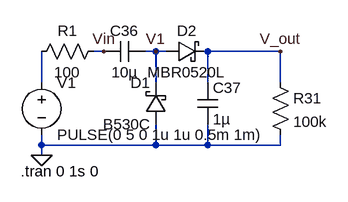
[diagram p0: schematic t_protection.asc]
t_protection.asc, the LTspice schematic file:
Version 4
SHEET 1 880 680
WIRE 112 80 96 80
WIRE 192 80 176 80
WIRE 208 80 192 80
WIRE 384 80 272 80
WIRE 16 128 16 80
WIRE 192 128 192 80
WIRE 272 128 272 80
WIRE 384 128 384 80
WIRE 16 224 16 208
WIRE 192 224 192 192
WIRE 192 224 16 224
WIRE 272 224 272 192
WIRE 272 224 192 224
WIRE 384 224 384 208
WIRE 384 224 272 224
WIRE 16 240 16 224
FLAG 16 240 0
FLAG 384 80 V_out
FLAG 112 80 Vin
FLAG 192 80 V1
SYMBOL voltage 16 112 R0
WINDOW 123 0 0 Left 0
WINDOW 39 0 0 Left 0
SYMATTR InstName V1
SYMATTR Value PULSE(0 5 0 1u 1u 0.5m 1m)
SYMBOL cap 176 64 R90
WINDOW 0 0 32 VBottom 2
WINDOW 3 32 32 VTop 2
SYMATTR InstName C36
SYMATTR Value 10µ
SYMBOL cap 256 128 R0
SYMATTR InstName C37
SYMATTR Value 1µ
SYMBOL res 368 112 R0
SYMATTR InstName R31
SYMATTR Value 100k
SYMBOL res 112 64 R90
WINDOW 0 0 56 VBottom 2
WINDOW 3 32 56 VTop 2
SYMATTR InstName R1
SYMATTR Value 100
SYMBOL schottky 208 192 R180
WINDOW 0 24 64 Left 2
WINDOW 3 24 0 Left 2
SYMATTR InstName D1
SYMATTR Value B530C
SYMATTR Description Diode
SYMATTR Type diode
SYMBOL schottky 208 96 R270
WINDOW 0 32 32 VTop 2
WINDOW 3 0 32 VBottom 2
SYMATTR InstName D2
SYMATTR Value MBR0520L
SYMATTR Description Diode
SYMATTR Type diode
TEXT -16 264 Left 2 !.tran 0 1s 0

The netlist it stands for:
* t_protection.asc
V1 N001 0 PULSE(0 5 0 1u 1u 0.5m 1m)
C36 V1 Vin 10µ
C37 V_out 0 1µ
R31 V_out 0 100k
R1 Vin N001 100
D1 0 V1 B530C
D2 V1 V_out MBR0520L
.model D D
.lib standard.dio
.tran 0 1s 0
.backanno
.end